# EAGLE schematic motor (EAGLE 7.0.0)
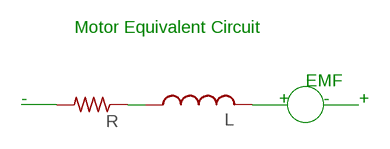
[diagram p0: schematic, sheet 1]

## Parts
L  L-US0204/5  [0204/5]
R  RESISTOR0204/5  [RES200MIL]

## Nets
N$1: L.1 R.1
N$3: R.2
N$4: L.2

## Notes on the sheet
- Motor Equivalent Circuit
- EMF
- - | + | - | +

## Library data of the parts
L = rcl:L-US: INDUCTOR, American symbol
R = EE445L:RESISTOR: RESISTOR, American symbol